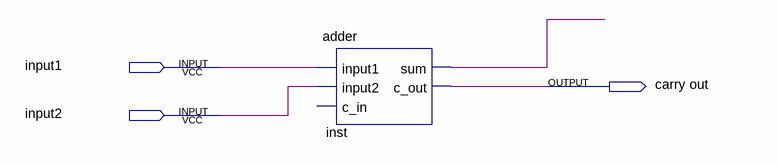
[diagram p0: schematic sheet]
// Quartus schematic block_adder.bdf as structural Verilog: 1 symbols, 3 pins
module block_adder (
  input  input1,
  input  input2,
  output \carry_out 
);

  wire inst_sum;

  adder inst (.input1(input1), .input2(input2), .sum(inst_sum), .c_out(\carry_out ));  // open: c_in
endmodule
